# EAGLE design Wifi Module Breakout (EAGLE 9.4.2)
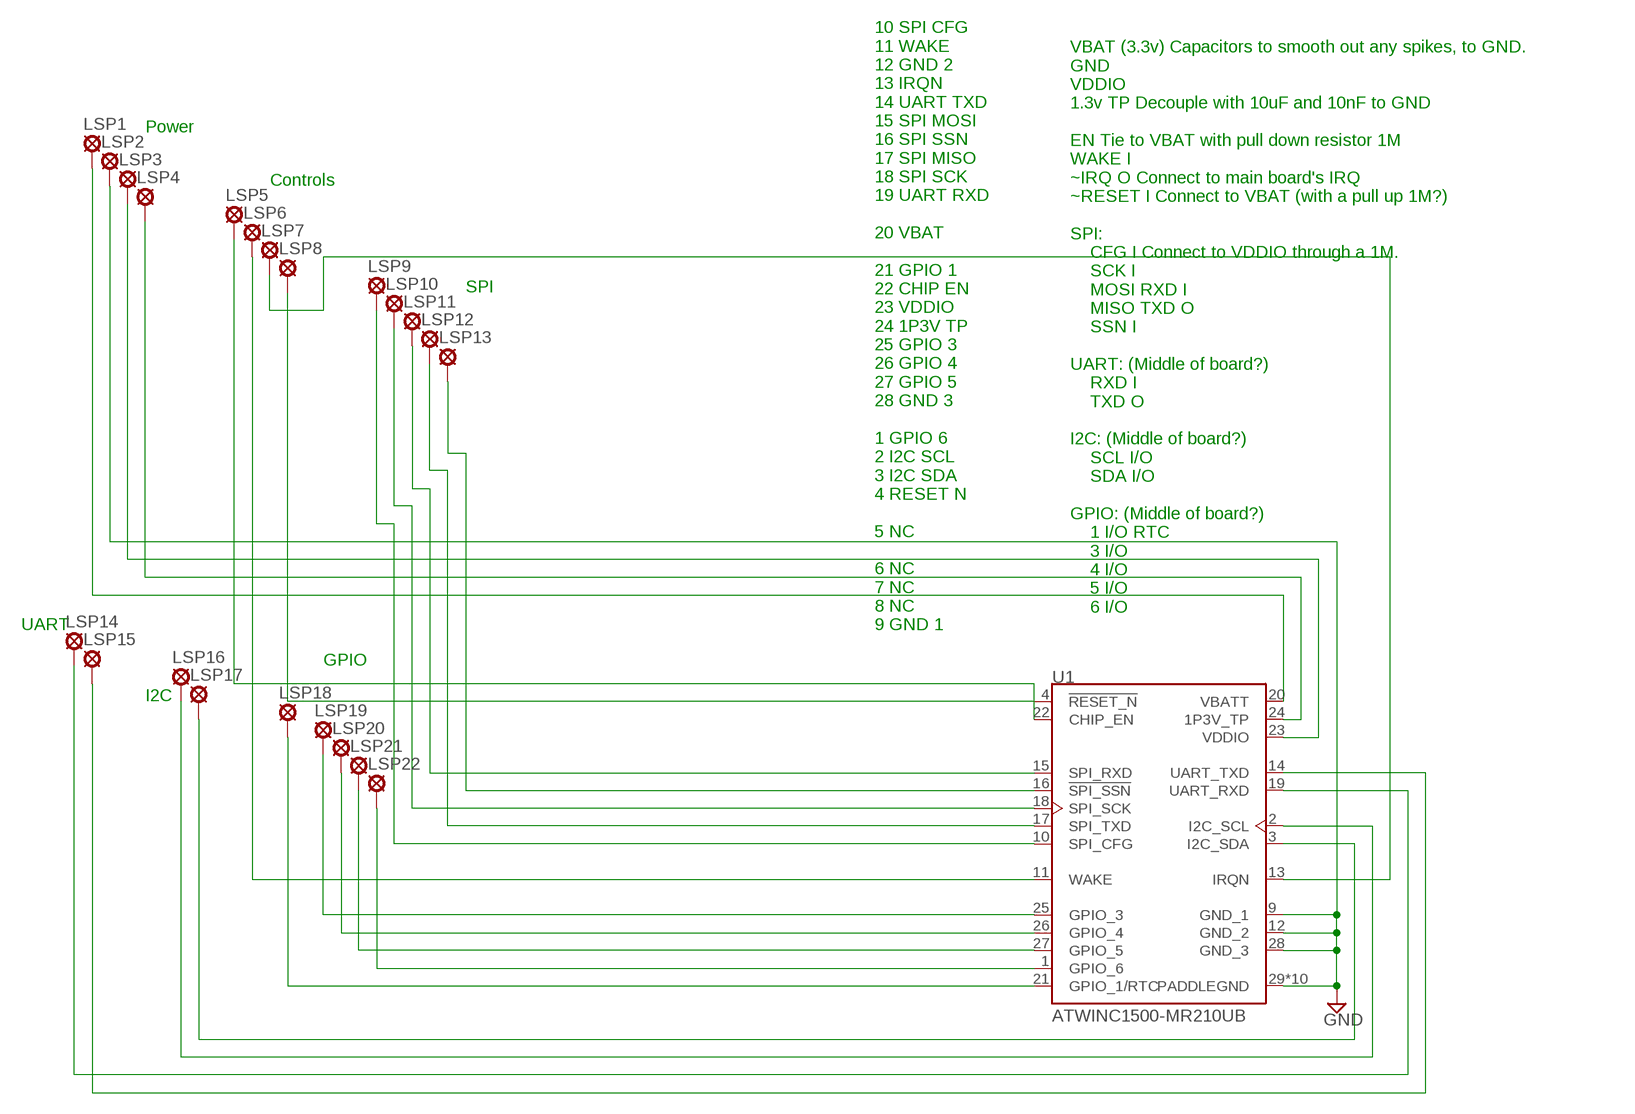
[diagram p0: schematic, sheet 1]

## Parts
LSP1  LSP10_CLSP10_C  [LSP10_C]
LSP2  LSP10_CLSP10_C  [LSP10_C]
LSP3  LSP10_CLSP10_C  [LSP10_C]
LSP4  LSP10_CLSP10_C  [LSP10_C]
LSP5  LSP10_CLSP10_C  [LSP10_C]
LSP6  LSP10_CLSP10_C  [LSP10_C]
LSP7  LSP10_CLSP10_C  [LSP10_C]
LSP8  LSP10_CLSP10_C  [LSP10_C]
LSP9  LSP10_CLSP10_C  [LSP10_C]
LSP10  LSP10_CLSP10_C  [LSP10_C]
LSP11  LSP10_CLSP10_C  [LSP10_C]
LSP12  LSP10_CLSP10_C  [LSP10_C]
LSP13  LSP10_CLSP10_C  [LSP10_C]
LSP14  LSP10_CLSP10_C  [LSP10_C]
LSP15  LSP10_CLSP10_C  [LSP10_C]
LSP16  LSP10_CLSP10_C  [LSP10_C]
LSP17  LSP10_CLSP10_C  [LSP10_C]
LSP18  LSP10_CLSP10_C  [LSP10_C]
LSP19  LSP10_CLSP10_C  [LSP10_C]
LSP20  LSP10_CLSP10_C  [LSP10_C]
LSP21  LSP10_CLSP10_C  [LSP10_C]
LSP22  LSP10_CLSP10_C  [LSP10_C]
U1  ATWINC1500-MR210UB  [MICROCHIP_ATWINC1500-MR210UB]

## Nets
GND: LSP2.P$1(MP) U1.9(GND_1) U1.12(GND_2) U1.28(GND_3) U1.29(PADDLEGND) U1.P$1(PADDLEGND) U1.P$2(PADDLEGND) U1.P$3(PADDLEGND) U1.P$4(PADDLEGND) U1.P$5(PADDLEGND) U1.P$6(PADDLEGND) U1.P$7(PADDLEGND) U1.P$8(PADDLEGND) U1.P$9(PADDLEGND)
N$1: LSP8.P$1(MP) U1.4(!RESET_N)
N$2: LSP7.P$1(MP) U1.13(IRQN)
N$3: LSP6.P$1(MP) U1.11(WAKE)
N$4: LSP5.P$1(MP) U1.22(CHIP_EN)
N$5: LSP1.P$1(MP) U1.20(VBATT)
N$6: LSP4.P$1(MP) U1.24(1P3V_TP)
N$7: LSP3.P$1(MP) U1.23(VDDIO)
N$12: LSP18.P$1(MP) U1.21(GPIO_1/RTC)
N$13: LSP19.P$1(MP) U1.25(GPIO_3)
N$14: LSP20.P$1(MP) U1.26(GPIO_4)
N$15: LSP21.P$1(MP) U1.27(GPIO_5)
N$16: LSP22.P$1(MP) U1.1(GPIO_6)
N$17: LSP16.P$1(MP) U1.2(I2C_SCL)
N$18: LSP17.P$1(MP) U1.3(I2C_SDA)
N$19: LSP14.P$1(MP) U1.19(UART_RXD)
N$20: LSP15.P$1(MP) U1.14(UART_TXD)
N$21: LSP9.P$1(MP) U1.10(SPI_CFG)
N$22: LSP10.P$1(MP) U1.18(SPI_SCK)
N$23: LSP11.P$1(MP) U1.15(SPI_RXD)
N$24: LSP12.P$1(MP) U1.17(SPI_TXD)
N$25: LSP13.P$1(MP) U1.16(!SPI_SSN)

## Notes on the sheet
- Power
- Controls
- SPI
- VBAT (3.3v) Capacitors to smooth out any spikes, to GND.
  GND
  VDDIO
  1.3v TP Decouple with 10uF and 10nF to GND
  
  EN Tie to VBAT with pull down resistor 1M
  WAKE I
  ~IRQ O Connect to main board's IRQ
  ~RESET I Connect to VBAT (with a pull up 1M?)
  
  SPI:
      CFG I Connect to VDDIO through a 1M.
      SCK I
      MOSI RXD I
      MISO TXD O
      SSN I
  
  UART: (Middle of board?)
      RXD I
      TXD O
  
  I2C: (Middle of board?)
      SCL I/O
      SDA I/O
  
  GPIO: (Middle of board?)
      1 I/O RTC
      3 I/O
      4 I/O
      5 I/O
      6 I/O
- UART
- 10 SPI CFG
  11 WAKE
  12 GND 2
  13 IRQN
  14 UART TXD
  15 SPI MOSI
  16 SPI SSN
  17 SPI MISO
  18 SPI SCK
  19 UART RXD
  
  20 VBAT
  
  21 GPIO 1
  22 CHIP EN
  23 VDDIO
  24 1P3V TP
  25 GPIO 3
  26 GPIO 4
  27 GPIO 5
  28 GND 3
  
  1 GPIO 6
  2 I2C SCL
  3 I2C SDA
  4 RESET N
  
  5 NC
  
  6 NC
  7 NC
  8 NC
  9 GND 1
- GPIO
- I2C

## Library data of the parts
LSP1-LSP22 = tbtaco-solpad:LSP10_C: SOLDER PAD drill 1.0 mm, distributor Buerklin, 12H555
U1 = ATWINC1500-MR210UB:ATWINC1500-MR210UB: SmartConnect ATWINC1500B-MU-T Module - SmartConnect ATWINC1500B-MU-T Module/ MODULE (R3); AVAILABILITY: Unavailable; DESCRIPTION: SmartConnect ATWINC1500B-MU-T Module - SmartConnect ATWINC1500B-MU-T Module/ MODULE _R3_; MF: Microchip; MP: ATWINC1500-MR210UB; PACKAGE: Module Microchip; PRICE: None

## Board
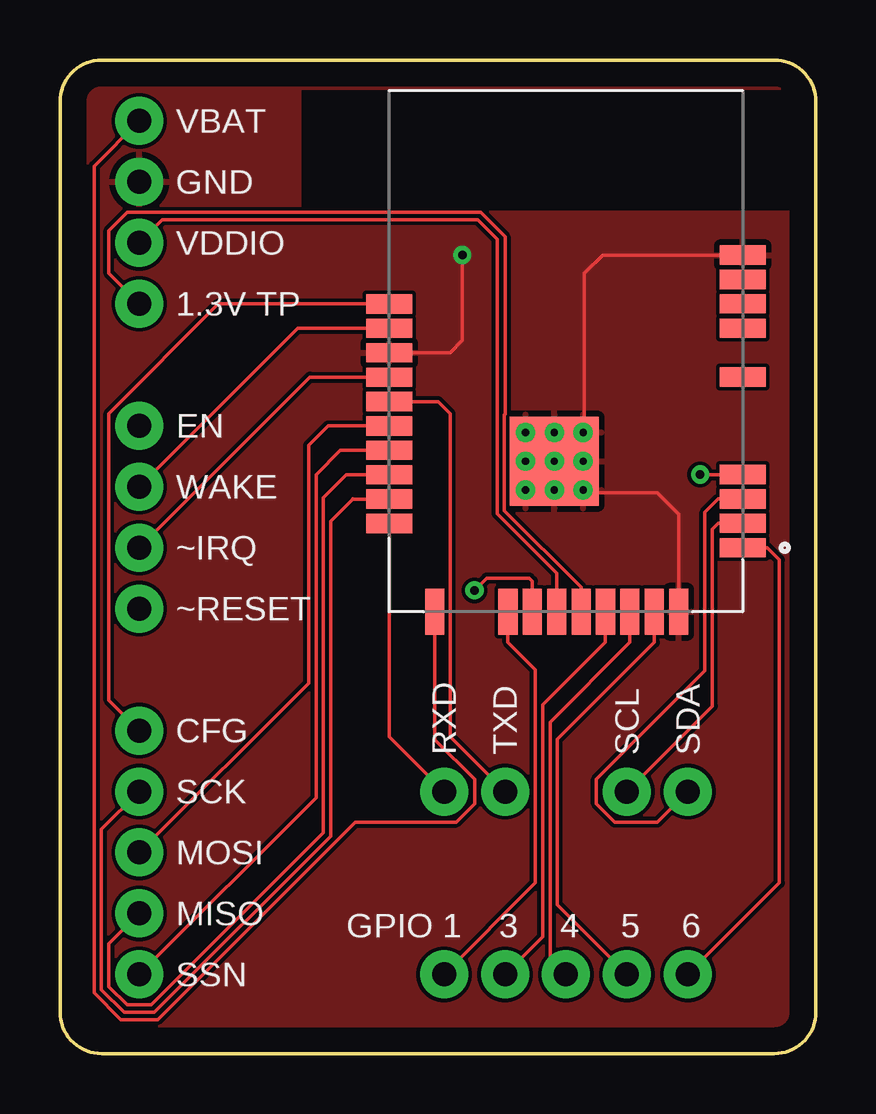
[diagram p1: board, top side]
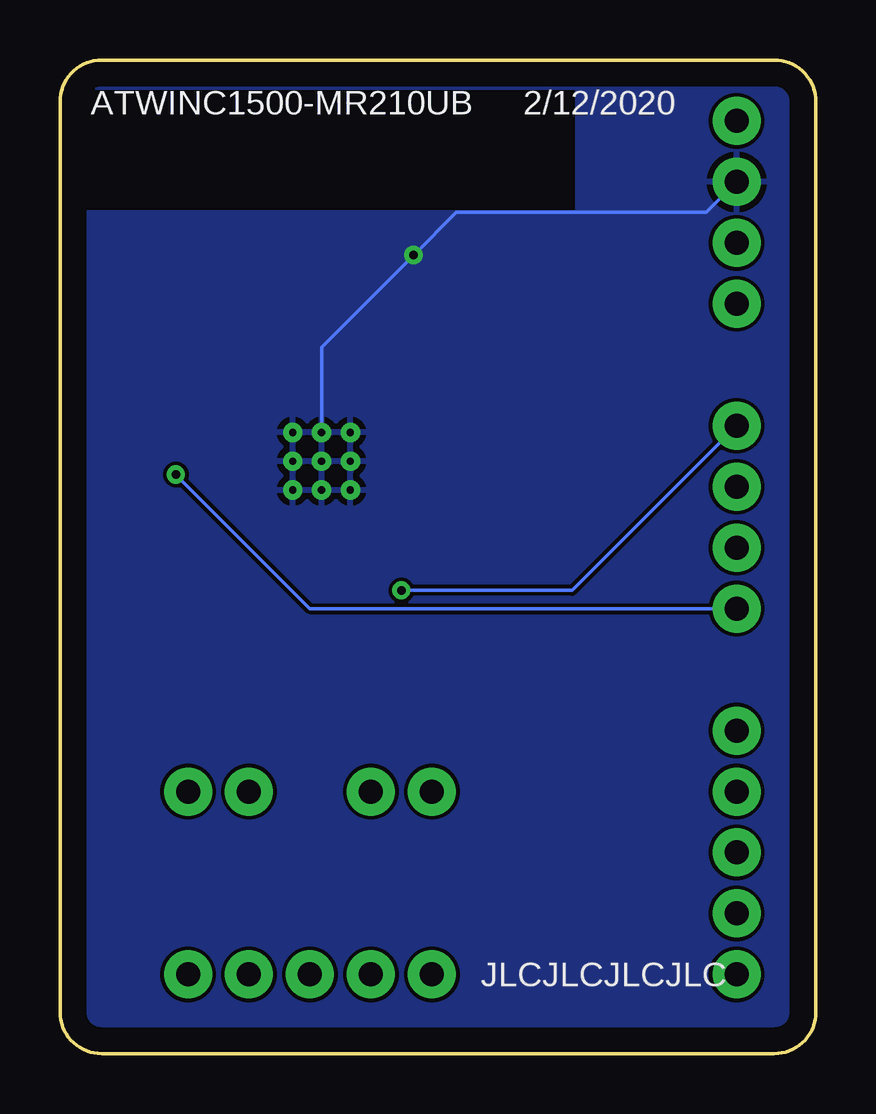
[diagram p2: board, bottom side, seen from below]

Size 31.5 x 41.4 mm. Coordinates in mm from the lower left corner, seen from the top.
Outline: 29.76,0 1.73,0 arc-90 0,1.73 0,39.67 arc-90 1.73,41.4 29.76,41.4 arc-90 31.5,39.67 31.5,1.73 arc-90 29.76,0
Copper layers (1*16): Top 0.035mm / dielectric 1.5mm / Bottom 0.035mm
Design rules "default": minimum track width 6mil, minimum drill 0.35mm, track to track 6mil, track to pad 6mil, pad to pad 6mil, via to via 6mil, smd to smd 6mil, copper to edge 40mil, drill to drill 6mil, minimum pad ring 10mil, minimum via ring 8mil, stop-mask expansion 4mil, vias tented up to drill 0mil, thermal gap 10mil

### Footprints (pad centres in the part's own frame; a part is rotated, then mirrored left to right if it is on the bottom)
LSP10_C = drill 1 pad 2: P$1 0,0
MICROCHIP_ATWINC1500-MR210UB = smd 1.9 x 0.8: 1 7.365,0; 2 7.365,1.016; 3 7.365,2.032; 4 7.365,3.048; 5 7.365,7.112; 6 7.365,9.144; 7 7.365,10.16; 8 7.365,11.176; 9 7.365,12.192; 10 -7.365,10.154; 11 -7.365,9.138; 12 -7.365,8.122; 13 -7.365,7.106; 14 -7.365,6.09; 15 -7.365,5.074; 16 -7.365,4.058; 17 -7.365,3.042; 18 -7.365,2.026; 19 -7.365,1.01 | smd 0.8 x 1.9: 20 -5.465,-2.67; 21 -2.417,-2.67; 22 -1.401,-2.67; 23 -0.385,-2.67; 24 0.631,-2.67; 25 1.647,-2.67; 26 2.663,-2.67; 27 3.679,-2.67; 28 4.695,-2.67 | smd 3.7 x 3.7: 29 -0.485,3.6 | drill 0.3 pad 0.5: P$1 -0.485,3.6; P$2 -1.685,3.6; P$3 0.715,3.6; P$4 -1.685,4.8; P$5 -0.485,4.8; P$6 0.715,4.8; P$7 -1.685,2.4; P$8 -0.485,2.4; P$9 0.715,2.4

### Placement (x,y rotation side)
LSP1  3.3,38.86 0 top
LSP2  3.3,36.32 0 top
LSP3  3.3,33.78 0 top
LSP4  3.3,31.24 0 top
LSP5  3.3,26.16 0 top
LSP6  3.3,23.62 0 top
LSP7  3.3,21.08 0 top
LSP8  3.3,18.54 0 top
LSP9  3.3,13.46 0 top
LSP10  3.3,10.92 0 top
LSP11  3.3,8.38 0 top
LSP12  3.3,5.84 0 top
LSP13  3.3,3.3 0 top
LSP14  16,10.92 0 top
LSP15  18.54,10.92 0 top
LSP16  23.62,10.92 0 top
LSP17  26.16,10.92 0 top
LSP18  16,3.3 0 top
LSP19  18.54,3.3 0 top
LSP20  21.08,3.3 0 top
LSP21  23.62,3.3 0 top
LSP22  26.16,3.3 0 top
U1  21.08,21.08 0 top

### Tracks (layer width: path | path; a pad name or v marks a point on that pad's centre or on a via)
GND  (via drill 0.35)
  Top 0.152: U1.P$1 21.84,25.93 21.84,32.51 22.61,33.27 U1.9 | U1.P$1 19.3,25.98 | U1.P$1 21.04,24.68 22.35,23.37 24.89,23.37 25.78,22.48 U1.28 | U1.12 13.72,29.21 16.26,29.21 16.76,29.72 v16.76,33.27
  Bottom 0.152: LSP2.P$1 4.57,35.05 14.99,35.05 v16.76,33.27 20.6,29.44 U1.P$5
  pour Top: 29.76,0 1.73,0 arc-90 0,1.73 0,39.67 arc-90 1.73,41.4 29.76,41.4 arc-90 31.5,39.67 31.5,1.73 arc-90
  pour Bottom: 29.76,0 1.73,0 arc-90 0,1.73 0,39.67 arc-90 1.73,41.4 29.76,41.4 arc-90 31.5,39.67 31.5,1.73 arc-90
N$1  (via drill 0.35)
  Top 0.152: v26.67,24.13 U1.4
  Bottom 0.152: v26.67,24.13 21.08,18.54 LSP8.P$1
N$2
  Top 0.152: LSP7.P$1 10.41,28.19 U1.13
N$3
  Top 0.152: LSP6.P$1 9.9,30.22 U1.11
N$4  (via drill 0.35)
  Top 0.152: U1.22 19.68,19.69 19.56,19.81 17.78,19.81 v17.27,19.3
  Bottom 0.152: LSP5.P$1 10.16,19.3 v17.27,19.3
N$5
  Top 0.152: LSP1.P$1 1.42,36.98 1.42,2.54 2.54,1.42 4.06,1.42 12.29,9.65 16.51,9.65 17.27,10.41 17.27,11.43 15.62,13.08 U1.20
N$6
  Top 0.152: LSP4.P$1 2.03,32.51 2.03,34.29 2.79,35.05 17.53,35.05 18.54,34.04 18.54,26.65 18.52,26.63 18.52,22.63 21.71,19.44 U1.24
N$7
  Top 0.152: U1.23 20.7,20.02 18.21,22.5 18.21,33.93 17.4,34.75 4.27,34.75 LSP3.P$1
N$12
  Top 0.152: U1.21 18.66,17.15 19.81,16 19.81,7.11 LSP18.P$1
N$13
  Top 0.152: LSP19.P$1 20.12,4.88 20.12,14.53 22.73,17.14 U1.25
N$14
  Top 0.152: U1.26 23.74,17.14 20.42,13.82 20.42,3.96 LSP20.P$1
N$15
  Top 0.152: LSP21.P$1 20.73,6.2 20.73,13.11 24.76,17.14 U1.27
N$16
  Top 0.152: LSP22.P$1 29.97,7.11 29.97,20.57 29.46,21.08 U1.1
N$17
  Top 0.152: LSP16.P$1 27.18,14.48 27.18,21.84 27.43,22.1 U1.2
N$18
  Top 0.152: LSP17.P$1 24.89,9.65 23.11,9.65 22.35,10.41 22.35,11.43 26.87,15.95 26.87,22.55 27.43,23.11 U1.3
N$19
  Top 0.152: U1.19 13.72,13.21 LSP14.P$1
N$20
  Top 0.152: LSP15.P$1 16.26,13.21 16.26,26.67 15.75,27.17 U1.14
N$21
  Top 0.152: LSP9.P$1 2.03,14.73 2.03,26.67 6.6,31.24 U1.10
N$22
  Top 0.152: U1.18 12.2,23.11 | 12.2,23.11 12.19,23.11 | LSP10.P$1 1.73,9.35 1.73,2.67 2.67,1.73 3.94,1.73 11.28,9.07 11.28,22.19 12.2,23.11
N$23
  Top 0.152: LSP11.P$1 10.36,15.44 10.36,25.35 11.17,26.16 U1.15
N$24
  Top 0.152: LSP12.P$1 2.03,4.57 2.03,2.79 2.79,2.03 3.81,2.03 10.97,9.2 10.97,23.16 11.93,24.12 U1.17
N$25
  Top 0.152: LSP13.P$1 10.67,10.67 10.67,24.13 11.68,25.14 U1.16

### Text on the board
tPlace: VBAT | GND | VDDIO | 1.3V TP | EN | WAKE | ~IRQ | ~RESET | CFG | RXD | TXD | SCL | SDA | SCK | MOSI | MISO | GPIO 1 | 3 | 4 | 5 | 6 | SSN
bPlace: 2/12/2020 | ATWINC1500-MR210UB | JLCJLCJLCJLC